# Altium schematic sheet Hydro_Node_Schematic.SchDoc
size A; SheetNumber: 1; SheetTotal: 1
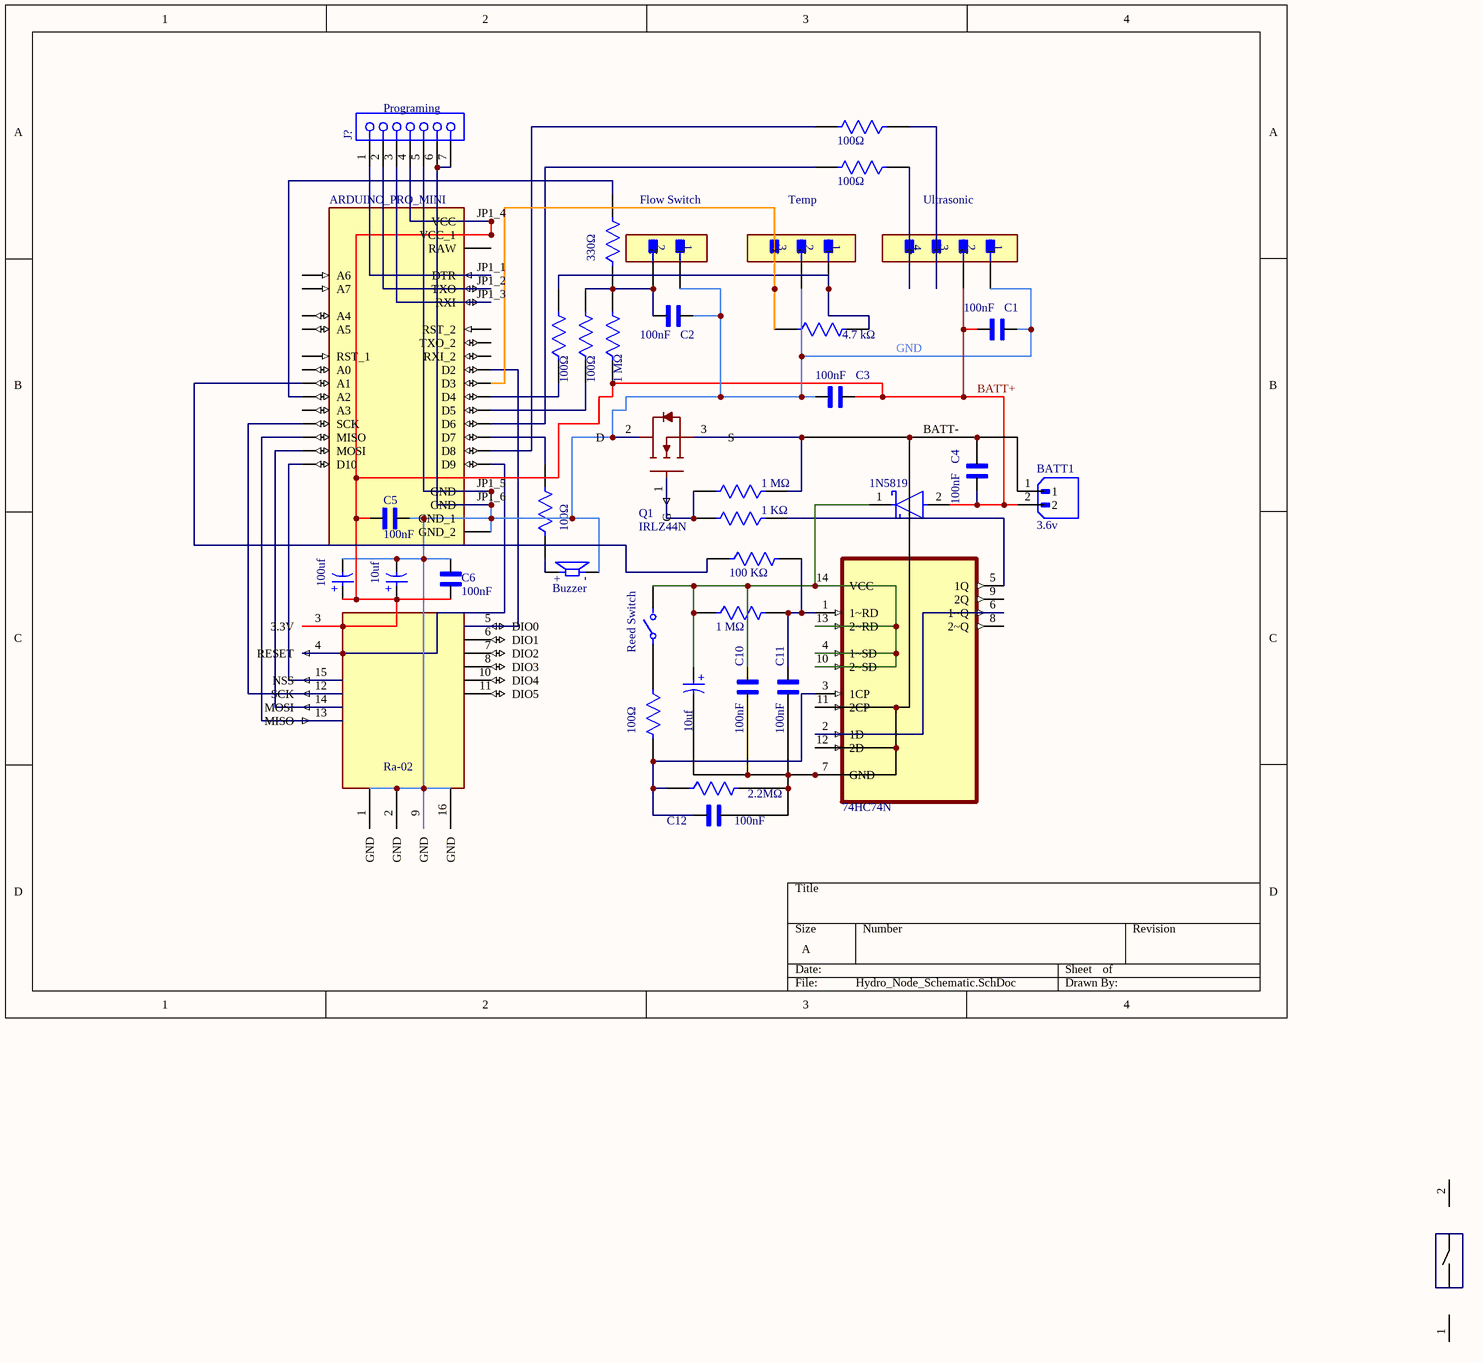
[diagram p0: Hydro_Node_Schematic.SchDoc]

## Parts
BATT1  3.6v  [JST_B2B-XH-A_(LF)(SN)]
C1  100nF  [CAPRR508W50L508T317H508]
C2  100nF  [CAPRR508W50L508T317H508]
C3  100nF  [CAPRR508W50L508T317H508]
C4  100nF  [CAPRR508W50L508T317H508]
C5  100nF  [CAPRR508W50L508T317H508]
C6  100nF  [CAPRR508W50L508T317H508]
C7  100uf  [WCAP-ATLL_D5H11]
C8  10uf  [WCAP-ATLL_D5H11]
C9  10uf  [WCAP-ATLL_D5H11]
C10  100nF  [CAPRR508W50L508T317H508]
C11  100nF  [CAPRR508W50L508T317H508]
C12  100nF  [CAPRR508W50L508T317H508]
D1  1N5819  [FP-DO-41_Plastic-MFG]
J1  Flow Switch  [FP-B2B-XH-AM_LF_SN-MFG]
J2  Temp  [FP-B3B-XH-A_LF_SN-MFG]
J3  Ultrasonic  [FP-B4B-XH-A_LF_SN-MFG]
J?  Programing  [61300711821]
LS1  Buzzer  [CUI_CPT-1255C-090]
Q1  IRLZ44N  [TO220AB_HORZ_TABDOWN_M3]
R1  100Ω  [FP-MFR-25-MFG]
R2  100Ω  [FP-MFR-25-MFG]
R3  330Ω  [FP-MFR-25-MFG]
R4  100Ω  [FP-MFR-25-MFG]
R5  100Ω  [FP-MFR-25-MFG]
R6  1 MΩ  [FP-MFR-25-MFG]
R7  4.7 kΩ  [FP-MFR-25-MFG]
R8  1 MΩ  [FP-MFR-25-MFG]
R9  100Ω  [FP-MFR-25-MFG]
R10  1 KΩ  [FP-MFR-25-MFG]
R11  100 KΩ  [FP-MFR-25-MFG]
R12  1 MΩ  [FP-MFR-25-MFG]
R13  100Ω  [FP-MFR-25-MFG]
R14  2.2MΩ  [FP-MFR-25-MFG]
S1  Reed Switch  [REEDSW-THT-D4L29-P35]
U1  ARDUINO_PRO_MINI  [MODULE_ARDUINO_PRO_MINI]
U2  74HC74N  [DIP254P762X420-14]
U3  Ra-02  [RA-02_BREAKOUT_THT_2X8]

## Nets
BATT+: BATT1.2 C1.1 C3.2 C4.2 C5.2 C6.1 C7.1(P) C8.1(P) D1.2(A) J3.2 J?.4 R6.1 U1.JP1_4(VCC) U1.JP6_4(VCC_1) U3.3(3.3V)
BATT-: BATT1.1 C4.1 C9.2(N) C10.2 C11.2 C12.2 Q1.3(S) R8.1 R14.2 U2.7(GND) U2.11(2CP) U2.12(2D)
GND: C1.2 C2.2 C3.1 C5.1 C6.2 C7.2(N) C8.2(N) J1.1 J2.2 J3.1 J?.5 J?.6 J?.7 LS1.N Q1.2(D) U1.JP1_5(GND) U1.JP1_6(GND) U1.JP6_2(GND_1) U1.JP7_9(GND_2) U3.1(GND) U3.2(GND) U3.9(GND) U3.16(GND)
NetC2_1: C2.1 J1.2 R3.1 R5.2 R6.2
NetC9_1: C9.1(P) C10.1 D1.1(C) R12.1 S1.2 U2.4(1~SD) U2.10(2~SD) U2.13(2~RD) U2.14(VCC)
NetC11_1: C11.1 R11.2 R12.2 U2.1(1~RD)
NetC12_1: C12.1 R13.2 R14.1 U2.3(1CP)
NetJ2_1: J2.1 R4.2 R7.2
NetJ2_3: J2.3 R7.1 U1.JP7_7(D3)
NetJ3_3: J3.3 R1.1
NetJ3_4: J3.4 R2.1
NetJ?_1: J?.1 U1.JP1_1(DTR)
NetJ?_2: J?.2 U1.JP1_2(TXO)
NetJ?_3: J?.3 U1.JP1_3(RXI)
NetLS1_P: LS1.P R9.1
NetQ1_1: Q1.1(G) R8.2 R10.2
NetR1_2: R1.2 U1.JP7_2(D8)
NetR2_2: R2.2 U1.JP7_4(D6)
NetR3_2: R3.2 U1.JP6_6(A2)
NetR4_1: R4.1 U1.JP7_6(D4)
NetR5_1: R5.1 U1.JP7_5(D5)
NetR9_2: R9.2 U1.JP7_3(D7)
NetR10_1: R10.1 U2.5(1Q)
NetR11_1: R11.1 U1.JP6_7(A1)
NetR13_1: R13.1 S1.1
NetU1_JP6_9: U1.JP6_9(SCK) U3.12(SCK)
NetU1_JP6_10: U1.JP6_10(MISO) U3.13(MISO)
NetU1_JP6_11: U1.JP6_11(MOSI) U3.14(MOSI)
NetU1_JP6_12: U1.JP6_12(D10) U3.15(NSS)
NetU1_JP7_1: U1.JP7_1(D9) U3.4(RESET)
NetU1_JP7_8: U1.JP7_8(D2) U3.5(DIO0)
NetU2_2: U2.2(1D) U2.6(1~Q)

Not connected (* = marked no-connect by the designer): U1 JP2_1(A4) JP2_2(A5) JP3_1(A6) JP3_2(A7) JP6_1(RAW) JP6_3(RST_1) JP6_5(A3) JP6_8(A0) JP7_10(RST_2) JP7_11(RXI_2) JP7_12(TXO_2); U2 8(2~Q) 9(2Q); U3 6(DIO1) 7(DIO2) 8(DIO3) 10(DIO4) 11(DIO5)

## Notes on the sheet
- (in symbol CMP-03913-53914479-2) +
- (in symbol CMP-03913-54007379-2) +
- (in symbol CPT-1255C-090) -; +

## Library data of the parts
BATT1 = B2B-XH-A_(LF)(SN): Connector Header Through Hole 2 position 0.098 (2.50mm); MF: JST Sales; MP: B2B-XH-A (LF)(SN); SnapEDA_Link: https://www.snapeda.com/parts/B2B-XH-A%20(LF)(SN)/JST+Sales+America+Inc./view-part/?ref=snap; Package: None; Value: *; Check_prices: https://www.snapeda.com/parts/B2B-XH-A%20(LF)(SN)/JST+Sales+America+Inc./view-part/?ref=eda
C1-C6 C10-C12 = SR215E104MARTR1.: SR Series 5.08x5.08 mm 100 nF 50 V Â±20% Tol. Z5U Radial Lead/SkyCapÂ®; MF: AVX; SnapEDA_Link: https://www.snapeda.com/parts/SR215E104MARTR1/AVX/view-part/?ref=snap; Package: Radial AVX Interconnect / Elco; Capacitance: 100nF; MP: SR215E104MARTR1; Check_prices: https://www.snapeda.com/parts/SR215E104MARTR1/AVX/view-part/?ref=eda
C7 = CMP-03913-54007379-2: WCAP-ATLL Aluminum Electrolytic Capacitors; Polarity: Polar; Impedance: 1.02Ω; Life (Hours): 4000hours; Voltage Rating: 10V; Capacitance: 100µF; Ripple Current: 222mA; Pitch: 2mm; Leakage Current: 10µA; Tolerance: 20%; Lead Pitch: 2.0066mm; Max Operating Temperature: 105°C; Min Operating Temperature: -55°C; Packaging: Tape & Box (TB); Length: 11mm; Height - Seated (Max): 12.4968mm; RoHS: Compliant; Case/Package: Radial; Diameter: 5mm; Mount: Through Hole
C8 C9 = CMP-03913-53914479-2: Alum. Electrolytic Cap 10UF 50V 5MM Radial Wcap-atll, Lifetime 4000H +105OC; Ripple Current: 120mA; Material: Aluminium; Leakage Current: 5µA; Pitch: 2mm; Capacitance: 10µF; Tolerance: 20%; Polarity: Polar; Impedance: 2.6Ω; Life (Hours): 4000hours; Length: 11mm; REACH SVHC: Unknown; Case/Package: Radial; Diameter: 5mm; Min Operating Temperature: -55°C; Voltage Rating: 50V; Mount: Through Hole; Lead Pitch: 2.0066mm; Packaging: Tape & Box (TB); Height: 11mm; Voltage Rating (DC): 50V; Height - Seated (Max): 12.4968mm; Max Operating Temperature: 105°C; RoHS: Compliant
D1 = CMP-12790-000042-1: DIODE SCHOTTKY 40V 1A DO41; Manufacturer: Diodes Inc.; Manufacturer Part Number: 1N5819-T; Max Surge Forward Current: 25A; Capacitance: 110 pF; Max Junction Temp: +125°C; Peak Reverse Current: 1mA; Value: 110 pF; Temperature Range Low: -65°C; Footprint Url: https://www.diodes.com/assets/Package-Files/DO-41-Plastic.pdf; Digikey Description: DIODE SCHOTTKY 40V 1A DO41; Category: Diode; Mouser Description: Schottky Diodes & Rectifiers Vr/40V Io/1A T/R; Device Class L2: Diodes; Temperature Range High: +125°C; RoHS: TRUE; Device Class L3: Schottky Diodes; ComponentLink2Description: Datasheet; Temperature: -65°C to +125°C; Reverse Voltage: 40V; Height: 2.72mm; ComponentLink2URL: https://www.diodes.com/assets/Datasheets/ds23001.pdf; Forward Current: 1A; Lead Free: Yes; Device Class L1: Discrete Semiconductors; Max Repetitive Reverse Voltage: 40V; Ipc Land Pattern Name: DIOPA1091W105L521D272; Automotive: No; Package: DO-41 (Plastic); Octopart: https://octopart.com/1n5819-t-diodes+inc.-55389586
J1 = CMP-17439-000037-1: CONN HEADER VERT 2POS 2.5MM; Max Voltage Rating (AC): 250V; Connector Type: Male Pin; Contact Resistance: 20mR; Max Current Rating: 3A; Number of Positions: 2; Series: XH; Contact Material: Brass; Mount: Through Hole; Housing Material: Polyamide; Contact Plating: Tin; Termination: Solder; Max Operating Temperature: 85°C; Depth: 5.75mm; Packaging: Bulk; Min Operating Temperature: -25°C; Contact Type: Male Pin; Color: Green; Pitch: 2.5mm; Length: 7.4mm; Lead Free: Lead Free; Number of Rows: 1; Fastening Type: Detent; Housing Color: White; Orientation: Straight
J2 = CMP-17439-000014-3: CONN HEADER VERT 3POS 2.5MM; Max Voltage Rating (DC): 250V; Number of Positions: 3; Current Rating: 3A; Gender: Male; Wire/Cable Gauge: 22AWG; Contact Resistance: 20mR; Insulation Resistance: 1GR; Insulation Material: Nylon; Contact Plating: Tin; Depth: 5.75mm; Contact Type: Male Pin; Max Operating Temperature: 85°C; Insulation Color: Natural; Voltage Rating (AC): 250V; Color: Natural; Connector Type: Header; Orientation: Straight; Fastening Type: Detent; Housing Color: White; Min Operating Temperature: -25°C; Termination: Solder; Voltage Rating: 250V; Series: XH; Pitch: 2.5mm; Contact Shape: Square; Number of Rows: 1; Lead Free: Lead Free; Packaging: Bulk; Mount: Through Hole; Flammability Rating: UL94 V-0; Max Voltage Rating (AC): 250V; REACH SVHC: No SVHC; Housing Material: Polyamide; Contact Material: Brass; Lead Pitch: 2.5mm; Contact Finish - Mating: TIN; Length: 9.9mm; Max Current Rating: 3A; Number of Contacts: 3
J3 = CMP-17439-000250-1: CONN HEADER VERT 4POS 2.5MM; Number of Contacts: 4; Contact Resistance: 20mR; Voltage Rating: 250V; Max Current Rating: 3A; Gender: Male; Wire/Cable Gauge: 22AWG; Mated Stacking Heights: 9.8mm; Insulation Resistance: 1GR; Orientation: Straight; Contact Type: Male Pin; Contact Finish - Mating: TIN; Series: XH; Max Voltage Rating (AC): 250V; Lead Pitch: 2.5mm; Contact Shape: Square; Insulation Color: Natural; Termination: Solder; Lead Free: Lead Free; Voltage Rating (AC): 250V; Number of Rows: 1; Flammability Rating: UL94 V-0; Number of Positions: 4; Max Operating Temperature: 85°C; Package Quantity: 500; Mount: Through Hole; REACH SVHC: No SVHC; Connector Type: Header; Insulation Material: Nylon; Fastening Type: Detent; Min Operating Temperature: -25°C; Housing Color: White; Packaging: Bulk; Contact Plating: Tin; Contact Material: Brass; Max Voltage Rating (DC): 250V; Housing Material: Polyamide; Color: Natural; Material: Polyamide; Pitch: 2.5mm; Depth: 5.75mm; Current Rating: 3A; Length: 12.4mm
J? = CMP-1502-01326-4: Btb Conn, Rcpt, 7Pos, 1Row, 2.54Mm Rohs Compliant: Yes; Gender: Female; Operating Supply Voltage: 250V; Current Rating: 3A; Contact Resistance: 20mΩ; Lead Pitch: 2.54mm; RoHS: Non-Compliant; Orientation: Vertical; Number of Pins: 7
LS1 = CPT-1255C-090: 12 mm, 20 Vp-p, 80 dB, Through Hole, Piezo Audio Transducer Buzzer; MF: Same Sky; SnapEDA_Link: https://www.snapeda.com/parts/CPT-1255C-090/Same+Sky/view-part/?ref=snap; Package: None; Value: *; MP: CPT-1255C-090; Check_prices: https://www.snapeda.com/parts/CPT-1255C-090/Same+Sky/view-part/?ref=eda
Q1 = IRLZ44N: N-Channel Logic-Level HEXFET Power MOSFET, 55V, 47A, Rds(on) 22mOhm @ Vgs=5V, TO-220AB; Manufacturer: Infineon Technologies (Intl. Rectifier); Manufacturer Part Number: IRLZ44NPBF; Vgs(th): 1.0 V ... 2.0 V (logic level); Tab: Tab is Drain metal - netless copper in the footprint; Value: IRLZ44N; Vdss: 55 V; Id: 47 A; Rds(on): 22 mOhm @ Vgs = 5 V; Package: TO-220AB; Mounting: Horizontal, tab down, M3 screw; HelpURL: https://www.infineon.com/part/IRLZ44N
R1 R2 R4 R5 R9 R13 = CMP-03413-000001-1: RES 100 OHM 1/4W 1% AXIAL; Manufacturer: Yageo; Manufacturer Part Number: MFR-25FBF52-100R; Temperature Coefficient: 100ppm/°C; Power Rating: 0.25W; Voltage Rating: 250V; Temperature: -55°C to +155°C; Automotive: No; Value: 100Ω; Temperature Range High: +155°C; Mouser Description: Metal Film Resistors 1.18K OHM 1/4W 1%; Digikey Description: RES 1.18K OHM 1/4W 1% AXIAL; Lead Free: Yes; Tolerance: 1%; ComponentLink2Description: Datasheet; ComponentLink2URL: https://www.yageo.com/upload/media/product/products/datasheet/lr/Yageo_LR_MFR_1.pdf; Temperature Range Low: -55°C; Package: MFR-25; Ipc Land Pattern Name: RESAD1000W75L680D260; Composition: Metal Film; Category: Res; Octopart: https://octopart.com/mfr-25fbf52-1k18-yageo-56251681; Series: MFR; Device Class L2: Resistors; Height: 2.6mm; Resistance: 100Ω; Device Class L3: Through-Hole Resistors; RoHS: TRUE; Device Class L1: Passive Components
R3 = CMP-03413-000001-1: RES 330 OHM 1/4W 1% AXIAL; Manufacturer: Yageo; Manufacturer Part Number: MFR-25FBF52-330R; Temperature Coefficient: 100ppm/°C; Power Rating: 0.25W; Voltage Rating: 250V; Temperature: -55°C to +155°C; Automotive: No; Value: 330Ω; Temperature Range High: +155°C; Mouser Description: Metal Film Resistors 1.18K OHM 1/4W 1%; Digikey Description: RES 1.18K OHM 1/4W 1% AXIAL; Lead Free: Yes; Tolerance: 1%; ComponentLink2Description: Datasheet; ComponentLink2URL: https://www.yageo.com/upload/media/product/products/datasheet/lr/Yageo_LR_MFR_1.pdf; Temperature Range Low: -55°C; Package: MFR-25; Ipc Land Pattern Name: RESAD1000W75L680D260; Composition: Metal Film; Category: Res; Octopart: https://octopart.com/mfr-25fbf52-1k18-yageo-56251681; Series: MFR; Device Class L2: Resistors; Height: 2.6mm; Resistance: 330Ω; Device Class L3: Through-Hole Resistors; RoHS: TRUE; Device Class L1: Passive Components
R6 = CMP-03413-000001-1: RES 1MΩ 1/4W 1% AXIAL; Manufacturer: Yageo; Manufacturer Part Number: MFR-25FBF52-1MΩ; Temperature Coefficient: 100ppm/°C; Power Rating: 0.25W; Voltage Rating: 250V; Temperature: -55°C to +155°C; Automotive: No; Value: 1 MΩ; Temperature Range High: +155°C; Mouser Description: Metal Film Resistors 1.18K OHM 1/4W 1%; Digikey Description: RES 1.18K OHM 1/4W 1% AXIAL; Lead Free: Yes; Tolerance: 1%; ComponentLink2Description: Datasheet; ComponentLink2URL: https://www.yageo.com/upload/media/product/products/datasheet/lr/Yageo_LR_MFR_1.pdf; Temperature Range Low: -55°C; Package: MFR-25; Ipc Land Pattern Name: RESAD1000W75L680D260; Composition: Metal Film; Category: Res; Octopart: https://octopart.com/mfr-25fbf52-1k18-yageo-56251681; Series: MFR; Device Class L2: Resistors; Height: 2.6mm; Resistance: 1 MΩ; Device Class L3: Through-Hole Resistors; RoHS: TRUE; Device Class L1: Passive Components
R7 = CMP-03413-000001-1: RES 4.7k 1/4W 1% AXIAL; Manufacturer: Yageo; Manufacturer Part Number: MFR-25FBF52-4K7; Temperature Coefficient: 100ppm/°C; Power Rating: 0.25W; Voltage Rating: 250V; Temperature: -55°C to +155°C; Automotive: No; Value: 4.7 kΩ; Temperature Range High: +155°C; Mouser Description: Metal Film Resistors 1.18K OHM 1/4W 1%; Digikey Description: RES 1.18K OHM 1/4W 1% AXIAL; Lead Free: Yes; Tolerance: 1%; ComponentLink2Description: Datasheet; ComponentLink2URL: https://www.yageo.com/upload/media/product/products/datasheet/lr/Yageo_LR_MFR_1.pdf; Temperature Range Low: -55°C; Package: MFR-25; Ipc Land Pattern Name: RESAD1000W75L680D260; Composition: Metal Film; Category: Res; Octopart: https://octopart.com/mfr-25fbf52-1k18-yageo-56251681; Series: MFR; Device Class L2: Resistors; Height: 2.6mm; Resistance: 4.7 kΩ; Device Class L3: Through-Hole Resistors; RoHS: TRUE; Device Class L1: Passive Components
R8 R12 = CMP-03413-000001-1: RES 1M OHM 1/4W 1% AXIAL; Manufacturer: Yageo; Manufacturer Part Number: MFR-25FBF52-1MΩ; Temperature Coefficient: 100ppm/°C; Power Rating: 0.25W; Voltage Rating: 250V; Temperature: -55°C to +155°C; Automotive: No; Value: 1 MΩ; Temperature Range High: +155°C; Lead Free: Yes; Tolerance: 1%; ComponentLink2Description: Datasheet; ComponentLink2URL: https://www.yageo.com/upload/media/product/products/datasheet/lr/Yageo_LR_MFR_1.pdf; Temperature Range Low: -55°C; Package: MFR-25; Ipc Land Pattern Name: RESAD1000W75L680D260; Composition: Metal Film; Category: Res; Octopart: https://octopart.com/mfr-25fbf52-1k18-yageo-56251681; Series: MFR; Device Class L2: Resistors; Height: 2.6mm; Resistance: 1 MΩ; Device Class L3: Through-Hole Resistors; RoHS: TRUE; Device Class L1: Passive Components
  R8: Mouser Description: Metal Film Resistors 1.18K OHM 1/4W 1%; Digikey Description: RES 1.18K OHM 1/4W 1% AXIAL
  R12: Mouser Description: Metal Film Resistors 1M OHM 1/4W 1%; Digikey Description: RES 1M OHM 1/4W 1% AXIAL
R10 = CMP-03413-000001-1: RES 1K OHM 1/4W 1% AXIAL; Manufacturer: Yageo; Manufacturer Part Number: MFR-25FBF52-1K; Value: 1kΩ; Temperature Coefficient: 100ppm/°C; Power Rating: 0.25W; Voltage Rating: 250V; Temperature: -55°C to +155°C; Automotive: No; Temperature Range High: +155°C; Mouser Description: Metal Film Resistors 1.18K OHM 1/4W 1%; Digikey Description: RES 1.18K OHM 1/4W 1% AXIAL; Lead Free: Yes; Tolerance: 1%; ComponentLink2Description: Datasheet; ComponentLink2URL: https://www.yageo.com/upload/media/product/products/datasheet/lr/Yageo_LR_MFR_1.pdf; Temperature Range Low: -55°C; Package: MFR-25; Ipc Land Pattern Name: RESAD1000W75L680D260; Composition: Metal Film; Category: Res; Octopart: https://octopart.com/mfr-25fbf52-1k18-yageo-56251681; Series: MFR; Device Class L2: Resistors; Height: 2.6mm; Resistance: 1kΩ; Device Class L3: Through-Hole Resistors; RoHS: TRUE; Device Class L1: Passive Components
R11 = CMP-03413-000001-1: RES 100K OHM 1/4W 1% AXIAL; Manufacturer: Yageo; Manufacturer Part Number: MFR-25FBF52-100K; Value: 100kΩ; Temperature Coefficient: 100ppm/°C; Power Rating: 0.25W; Voltage Rating: 250V; Temperature: -55°C to +155°C; Automotive: No; Temperature Range High: +155°C; Mouser Description: Metal Film Resistors 100K OHM 1/4W 1%; Digikey Description: RES 100K OHM 1/4W 1% AXIAL; Lead Free: Yes; Tolerance: 1%; ComponentLink2Description: Datasheet; ComponentLink2URL: https://www.yageo.com/upload/media/product/products/datasheet/lr/Yageo_LR_MFR_1.pdf; Temperature Range Low: -55°C; Package: MFR-25; Ipc Land Pattern Name: RESAD1000W75L680D260; Composition: Metal Film; Category: Res; Octopart: https://octopart.com/mfr-25fbf52-1k18-yageo-56251681; Series: MFR; Device Class L2: Resistors; Height: 2.6mm; Resistance: 100kΩ; Device Class L3: Through-Hole Resistors; RoHS: TRUE; Device Class L1: Passive Components
R14 = CMP-03413-000001-1: RES 2.2M OHM 1/4W 1% AXIAL; Manufacturer: Yageo; Manufacturer Part Number: MFR-25FBF52-2.2M; Temperature Coefficient: 100ppm/°C; Power Rating: 0.25W; Voltage Rating: 250V; Temperature: -55°C to +155°C; Automotive: No; Value: 2.2MΩ; Temperature Range High: +155°C; Mouser Description: Metal Film Resistors 2.2M OHM 1/4W 1%; Digikey Description: RES 2.2M OHM 1/4W 1% AXIAL; Lead Free: Yes; Tolerance: 1%; ComponentLink2Description: Datasheet; ComponentLink2URL: https://www.yageo.com/upload/media/product/products/datasheet/lr/Yageo_LR_MFR_1.pdf; Temperature Range Low: -55°C; Package: MFR-25; Ipc Land Pattern Name: RESAD1000W75L680D260; Composition: Metal Film; Category: Res; Octopart: https://octopart.com/mfr-25fbf52-1k18-yageo-56251681; Series: MFR; Device Class L2: Resistors; Height: 2.6mm; Resistance: 2.2MΩ; Device Class L3: Through-Hole Resistors; RoHS: TRUE; Device Class L1: Passive Components
S1 = REED-SWITCH-NO-D4L29: Magnetic reed switch, normally open, glass body 4.0 x 29.0 mm, axial leads bent for 35.0 mm through-hole pitch; Manufacturer Part Number: MDSM-4R-12-18; Manufacturer: Littelfuse; Standoff Height: 0mm; Value: SPST-NO Reed; Body Size: 4.0 x 29.0 mm glass; Contact Rating: TBD - see datasheet; Pull-In Sensitivity: TBD AT; Device Class L3: unset; Octopart: https://octopart.com/mdsm-4r-12-18-littelfuse-55632078; Device Class L1: Electromechanical; Mouser Description: Magnetic / Reed Switches MDSM-4R 5277 12-18; Category: Switch; ComponentLink2Description: Datasheet; RoHS: TRUE; Height: 2.84mm; Temperature: -40°C to +125°C; Lead Free: Yes; Package: MDSM-4; Temperature Range High: +125°C; Temperature Range Low: -40°C; Device Class L2: Switches; Automotive: No; Digikey Description: SWITCH REED SPST-NO 350MA 140V; ComponentLink2URL: https://www.littelfuse.com/~/media/electronics/datasheets/reed_switches/littelfuse_reed_switches_mdsm_4_datasheet.pdf.pdf; Lead Pitch: 35.0 mm
U1 = ARDUINO_PRO_MINI: This board was developed for applications and installations where space is premium and projects are made as permanent set ups. Small, available in 3.3 V and 5 V versions, powered by ATmega328P.; MP: Arduino Pro Mini; SnapEDA_Link: https://www.snapeda.com/parts/Arduino%20Pro%20Mini/Arduino/view-part/?ref=snap; Package: None; Value: *; MF: Arduino; Check_prices: https://www.snapeda.com/parts/Arduino%20Pro%20Mini/Arduino/view-part/?ref=eda
U2 = 74HC74N,652: Flip Flop 2 Element D-Type 1 Bit Positive Edge 14-DIP (0.300, 7.62mm); MF: Nexperia; SnapEDA_Link: https://www.snapeda.com/parts/74HC74N,652/Nexperia/view-part/?ref=snap; Package: None; Value: *; MP: 74HC74N,652; Check_prices: https://www.snapeda.com/parts/74HC74N,652/Nexperia/view-part/?ref=eda
U3 = Ra-02: Ai-Thinker Ra-02 LoRa transceiver module, SX1278, 410-525 MHz, +18 dBm, SPI, IPEX antenna, SMD-16; Manufacturer: Ai-Thinker; Manufacturer Part Number: Ra-02; LCSC: C90039; Frequency: 410-525 MHz